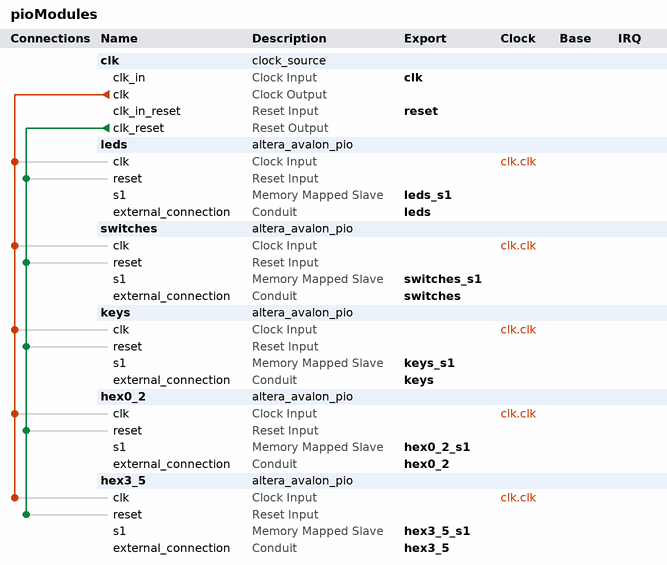
[diagram p0: system contents]
# Platform Designer (Qsys) system pioModules, Cyclone V 5CSEMA5F31C6
# Parameters at their usual value, and those the tool derives, are not listed.
package require -exact qsys 17.1
create_system pioModules
set_project_property DEVICE_FAMILY {Cyclone V}
set_project_property DEVICE 5CSEMA5F31C6

add_instance clk clock_source 17.1
set_instance_parameter_value clk clockFrequency 50000000

add_instance leds altera_avalon_pio 17.1
set_instance_parameter_value leds direction Output
set_instance_parameter_value leds resetValue 1
set_instance_parameter_value leds width 10

add_instance switches altera_avalon_pio 17.1
set_instance_parameter_value switches direction Input
set_instance_parameter_value switches width 10

add_instance keys altera_avalon_pio 17.1
set_instance_parameter_value keys direction Input
set_instance_parameter_value keys width 3

add_instance hex0_2 altera_avalon_pio 17.1
set_instance_parameter_value hex0_2 direction Output
set_instance_parameter_value hex0_2 resetValue 15
set_instance_parameter_value hex0_2 width 21

add_instance hex3_5 altera_avalon_pio 17.1
set_instance_parameter_value hex3_5 direction Output
set_instance_parameter_value hex3_5 resetValue 15
set_instance_parameter_value hex3_5 width 21

# connections
add_connection clk.clk hex0_2.clk clock
add_connection clk.clk hex3_5.clk clock
add_connection clk.clk keys.clk clock
add_connection clk.clk leds.clk clock
add_connection clk.clk switches.clk clock
add_connection clk.clk_reset hex0_2.reset reset
add_connection clk.clk_reset hex3_5.reset reset
add_connection clk.clk_reset keys.reset reset
add_connection clk.clk_reset leds.reset reset
add_connection clk.clk_reset switches.reset reset

# exported interfaces
add_interface clk clock sink
set_interface_property clk EXPORT_OF clk.clk_in
add_interface hex0_2 conduit end
set_interface_property hex0_2 EXPORT_OF hex0_2.external_connection
add_interface hex0_2_s1 avalon slave
set_interface_property hex0_2_s1 EXPORT_OF hex0_2.s1
add_interface hex3_5 conduit end
set_interface_property hex3_5 EXPORT_OF hex3_5.external_connection
add_interface hex3_5_s1 avalon slave
set_interface_property hex3_5_s1 EXPORT_OF hex3_5.s1
add_interface keys conduit end
set_interface_property keys EXPORT_OF keys.external_connection
add_interface keys_s1 avalon slave
set_interface_property keys_s1 EXPORT_OF keys.s1
add_interface leds conduit end
set_interface_property leds EXPORT_OF leds.external_connection
add_interface leds_s1 avalon slave
set_interface_property leds_s1 EXPORT_OF leds.s1
add_interface reset reset sink
set_interface_property reset EXPORT_OF clk.clk_in_reset
add_interface switches conduit end
set_interface_property switches EXPORT_OF switches.external_connection
add_interface switches_s1 avalon slave
set_interface_property switches_s1 EXPORT_OF switches.s1

set_interconnect_requirement {$system} qsys_mm.clockCrossingAdapter HANDSHAKE
set_interconnect_requirement {$system} qsys_mm.enableEccProtection FALSE
set_interconnect_requirement {$system} qsys_mm.insertDefaultSlave FALSE
set_interconnect_requirement {$system} qsys_mm.maxAdditionalLatency 1

save_system pioModules.qsys
